# Altium project ESP32S3 Core.PrjPcb
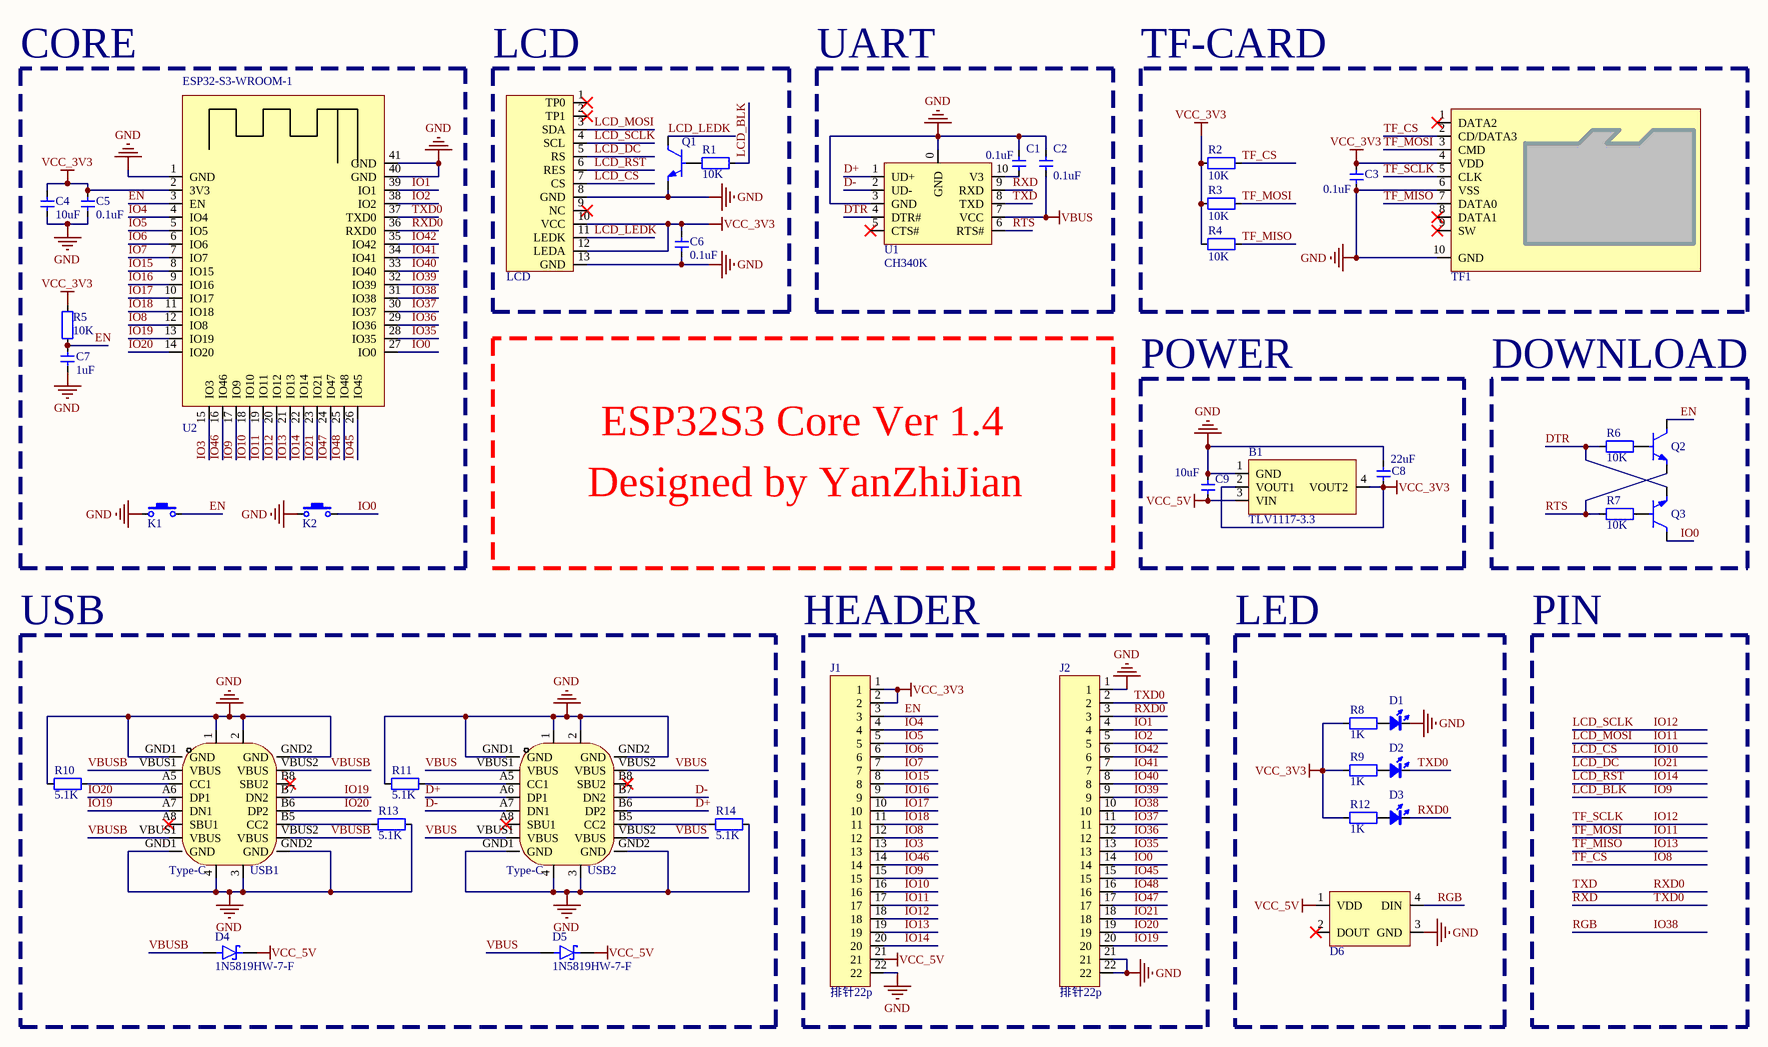
[diagram p0: ESP32S3 Core.SchDoc]
1 sheet, 43 parts. Net scope: global (net labels, ports and power ports of the same name join across sheets).
Board file: ESP32S3 Core.PcbDoc

## Sheet ESP32S3 Core.SchDoc
size A3; SheetNumber: 1; SheetTotal: 1

### Parts
B1  TLV1117-3.3  [SOT-223]
C1  0.1uF  [CAP_0402]
C2  0.1uF  [CAP_0402]
C3  0.1uF  [CAP_0402]
C4  10uF  [CAP_0402]
C5  0.1uF  [CAP_0402]
C6  0.1uF  [CAP_0402]
C7  1uF  [CAP_0402]
C8  22uF  [C 1206]
C9  10uF  [C 1206]
D1  color?  [LED_0402_RED]  (value not drawn)
D2  color?  [LED_0402_GREEN]  (value not drawn)
D3  color?  [LED_0402_BLUE]  (value not drawn)
D4  1N5819HW-7-F  [SOD-123]
D5  1N5819HW-7-F  [SOD-123]
D6  (no value)  [LED_5050_WS2812B]
J1  排针22p  [排针22P]
J2  排针22p  [排针22P]
K1  TACT 2P  [ButtonTACT_3x4x2_180]  (value not drawn)
K2  TACT 2P  [ButtonTACT_3x4x2_180]  (value not drawn)
LCD?  LCD  [LCD-80x160 0.96 13P]
Q1  Value  [SOT23_3]  (value not drawn)
Q2  Value  [SOT23_3]  (value not drawn)
Q3  Value  [SOT23_3]  (value not drawn)
R1  10K  [RES_0402]
R2  10K  [RES_0402]
R3  10K  [RES_0402]
R4  10K  [RES_0402]
R5  10K  [RES_0402]
R6  10K  [RES_0402]
R7  10K  [RES_0402]
R8  1K  [RES_0402]
R9  1K  [RES_0402]
R10  5.1K  [RES_0402]
R11  5.1K  [RES_0402]
R12  1K  [RES_0402]
R13  5.1K  [RES_0402]
R14  5.1K  [RES_0402]
TF1  TF  [TF-SOCKET]  (value not drawn)
U1  CH340K  [ESSOP10]
U2  ESP32-S3-WROOM-1  [ESP32S3WROOM1N16R8]  (value not drawn)
USB1  Type-C  [USB TYPE-C 16P]
USB2  Type-C  [USB TYPE-C 16P]

### Blocks framed on the sheet
CORE: C4 C5 C7 K1 K2 R5 U2
LCD: C6 LCD? Q1 R1
UART: C1 C2 U1
TF-CARD: C3 R2-R4 TF1
POWER: B1 C8 C9
DOWNLOAD: Q2 Q3 R6 R7
USB: D4 D5 R10 R11 R13 R14 USB1 USB2
HEADER: J1 J2
LED: D1-D3 D6 R8 R9 R12

### Nets
GND: B1.1(GND) C1.2 C2.2 C3.1 C4.1 C5.1 C6.1 C7.1 C8.2 C9.2 D1.2(K) D6.3(GND) J1.22 J2.1 J2.21 J2.22 K1.1 K2.1 LCD?.8(GND) LCD?.13(GND) Q1.2 R10.2 R11.2 R13.1 R14.1 TF1.6(VSS) TF1.10(GND) U1.0(GND) U1.3(GND) U2.1(GND) U2.40(GND) U2.41(GND) USB1.1 USB1.2 USB1.3 USB1.4 USB1.GND1(GND) USB1.GND2(GND) USB2.1 USB2.2 USB2.3 USB2.4 USB2.GND1(GND) USB2.GND2(GND)
VBUS: C2.1 D5.A U1.7(VCC) USB2.VBUS1(VBUS) USB2.VBUS2(VBUS)
VCC_3V3: B1.2(VOUT1) B1.4(VOUT2) C3.2 C4.2 C5.2 C6.2 C8.1 J1.1 J1.2 LCD?.10(VCC) LCD?.12(LEDA) R2.1 R3.1 R4.1 R5.2 R8.1 R9.1 R12.1 TF1.4(VDD) U2.2(3V3)
VCC_5V: B1.3(VIN) C9.1 D4.C(K) D5.C(K) D6.1(VDD) J1.21
D+: U1.1(UD+) USB2.A6(DP1) USB2.B6(DP2)
D-: U1.2(UD-) USB2.A7(DN1) USB2.B7(DN2)
DTR: Q3.2 R6.1 U1.4(DTR#)
EN: C7.2 J1.3 K1.2 Q2.3 R5.1 U2.3(EN)
IO0: J2.14 K2.2 Q3.3 U2.27(IO0)
IO1: J2.4 U2.39(IO1)
IO2: J2.5 U2.38(IO2)
IO3: J1.13 U2.15(IO3)
IO4: J1.4 U2.4(IO4)
IO5: J1.5 U2.5(IO5)
IO6: J1.6 U2.6(IO6)
IO7: J1.7 U2.7(IO7)
IO8: J1.12 R2.2 TF1.2(CD/DATA3) U2.12(IO8)  [also labelled TF_CS]
IO9: J1.15 R1.1 U2.17(IO9)  [also labelled LCD_BLK]
IO10: J1.16 LCD?.7(CS) U2.18(IO10)  [also labelled LCD_CS]
IO11: J1.17 LCD?.3(SDA) R3.2 TF1.3(CMD) U2.19(IO11)  [also labelled LCD_MOSI, TF_MOSI]
IO12: J1.18 LCD?.4(SCL) TF1.5(CLK) U2.20(IO12)  [also labelled LCD_SCLK, TF_SCLK]
IO13: J1.19 R4.2 TF1.7(DATA0) U2.21(IO13)  [also labelled TF_MISO]
IO14: J1.20 LCD?.6(RES) U2.22(IO14)  [also labelled LCD_RST]
IO15: J1.8 U2.8(IO15)
IO16: J1.9 U2.9(IO16)
IO17: J1.10 U2.10(IO17)
IO18: J1.11 U2.11(IO18)
IO19: J2.20 U2.13(IO19) USB1.A7(DN1) USB1.B7(DN2)
IO20: J2.19 U2.14(IO20) USB1.A6(DP1) USB1.B6(DP2)
IO21: J2.18 LCD?.5(RS) U2.23(IO21)  [also labelled LCD_DC]
IO35: J2.13 U2.28(IO35)
IO36: J2.12 U2.29(IO36)
IO37: J2.11 U2.30(IO37)
IO38: D6.4(DIN) J2.10 U2.31(IO38)  [also labelled RGB]
IO39: J2.9 U2.32(IO39)
IO40: J2.8 U2.33(IO40)
IO41: J2.7 U2.34(IO41)
IO42: J2.6 U2.35(IO42)
IO45: J2.15 U2.26(IO45)
IO46: J1.14 U2.16(IO46)
IO47: J2.17 U2.24(IO47)
IO48: J2.16 U2.25(IO48)
LCD_LEDK: LCD?.11(LEDK) Q1.3
RTS: Q2.2 R7.1 U1.6(RTS#)
RXD: D2.2(K) J2.2 U1.9(RXD) U2.37(TXD0)  [also labelled TXD0]
RXD0: D3.2(K) J2.3 U1.8(TXD) U2.36(RXD0)  [also labelled TXD]
VBUSB: D4.A USB1.VBUS1(VBUS) USB1.VBUS2(VBUS)
NetC1_1: C1.1 U1.10(V3)
NetD1_1: D1.1(A) R8.2
NetD2_1: D2.1(A) R9.2
NetD3_1: D3.1(A) R12.2
NetQ1_1: Q1.1 R1.2
NetQ2_1: Q2.1 R6.2
NetQ3_1: Q3.1 R7.2
NetR10_1: R10.1 USB1.A5(CC1)
NetR11_1: R11.1 USB2.A5(CC1)
NetR13_2: R13.2 USB1.B5(CC2)
NetR14_2: R14.2 USB2.B5(CC2)

Not connected (* = marked no-connect by the designer): D6 2(DOUT)*; LCD? 1(TP0)* 2(TP1)* 9(NC)*; TF1 1(DATA2)* 8(DATA1)* 9(SW)*; U1 5(CTS#)*; USB1 A8(SBU1)* B8(SBU2)*; USB2 A8(SBU1)* B8(SBU2)*

### Notes on the sheet
- ESP32S3 Core Ver 1.4
- Designed by YanZhiJian
- PIN

### Library data of the parts
B1 = CJT1117-3.3: LDO; Manufacturer_Name: Advanced Monolithic Systems; Manufacturer_Part_Number: AMS1117-3.3; Geometry.Height: 1.8mm; Mouser Part Number: *; Mouser Price/Stock: *; Arrow Part Number: *; Arrow Price/Stock: *; Datasheet Link: http://www.advanced-monolithic.com/pdf/ds1117.pdf
C1-C7 = 电容-0402: Capacitor; Value: 0.1u
C8 C9 = 电容-1206: Capacitor; Value: 0.1u
D1-D3 = LED_0402: LED; Type: 0402; Value: color?
D4 D5 = 1N5819HW-7-F: Diode Schottky 40 V 1A Surface Mount SOD-123; MF: Diodes Inc.; Value: *; SnapEDA_Link: https://www.snapeda.com/parts/1N5819HW-7-F/Diodes+Inc./view-part/?ref=snap; Purchase-URL: https://pricing.snapeda.com/search/part/1N5819HW-7-F/?ref=eda; Availability: In Stock; Price: None; Package: SOD-123 Fairchild Semiconductor; Check_prices: https://www.snapeda.com/parts/1N5819HW-7-F/Diodes+Inc./view-part/?ref=eda; MP: 1N5819HW-7-F
D6 = LED_5050_WS2812B: LED
K1 K2 = ButtonTACT_3x4x2_180: Button; value: 3x4; type: TACT 2P
LCD? = LCD-80x160 0.96: 0.96 LCD 80*160; BOM名称: 12864 点阵屏; 版权归属: 正点原子; Parameter: 显示器件; 学习资源: www.openedv.com
Q1-Q3 = BJT_NPN: Triode_NPN_SMD
R1-R14 = 电阻-0402: Resistor; Value: 22R
TF1 = TF卡座
U1 = CH340K: USB to TTL Serial / UART for dual power
USB1 USB2 = USB-Type-C 16P: USB-Type-C_16P